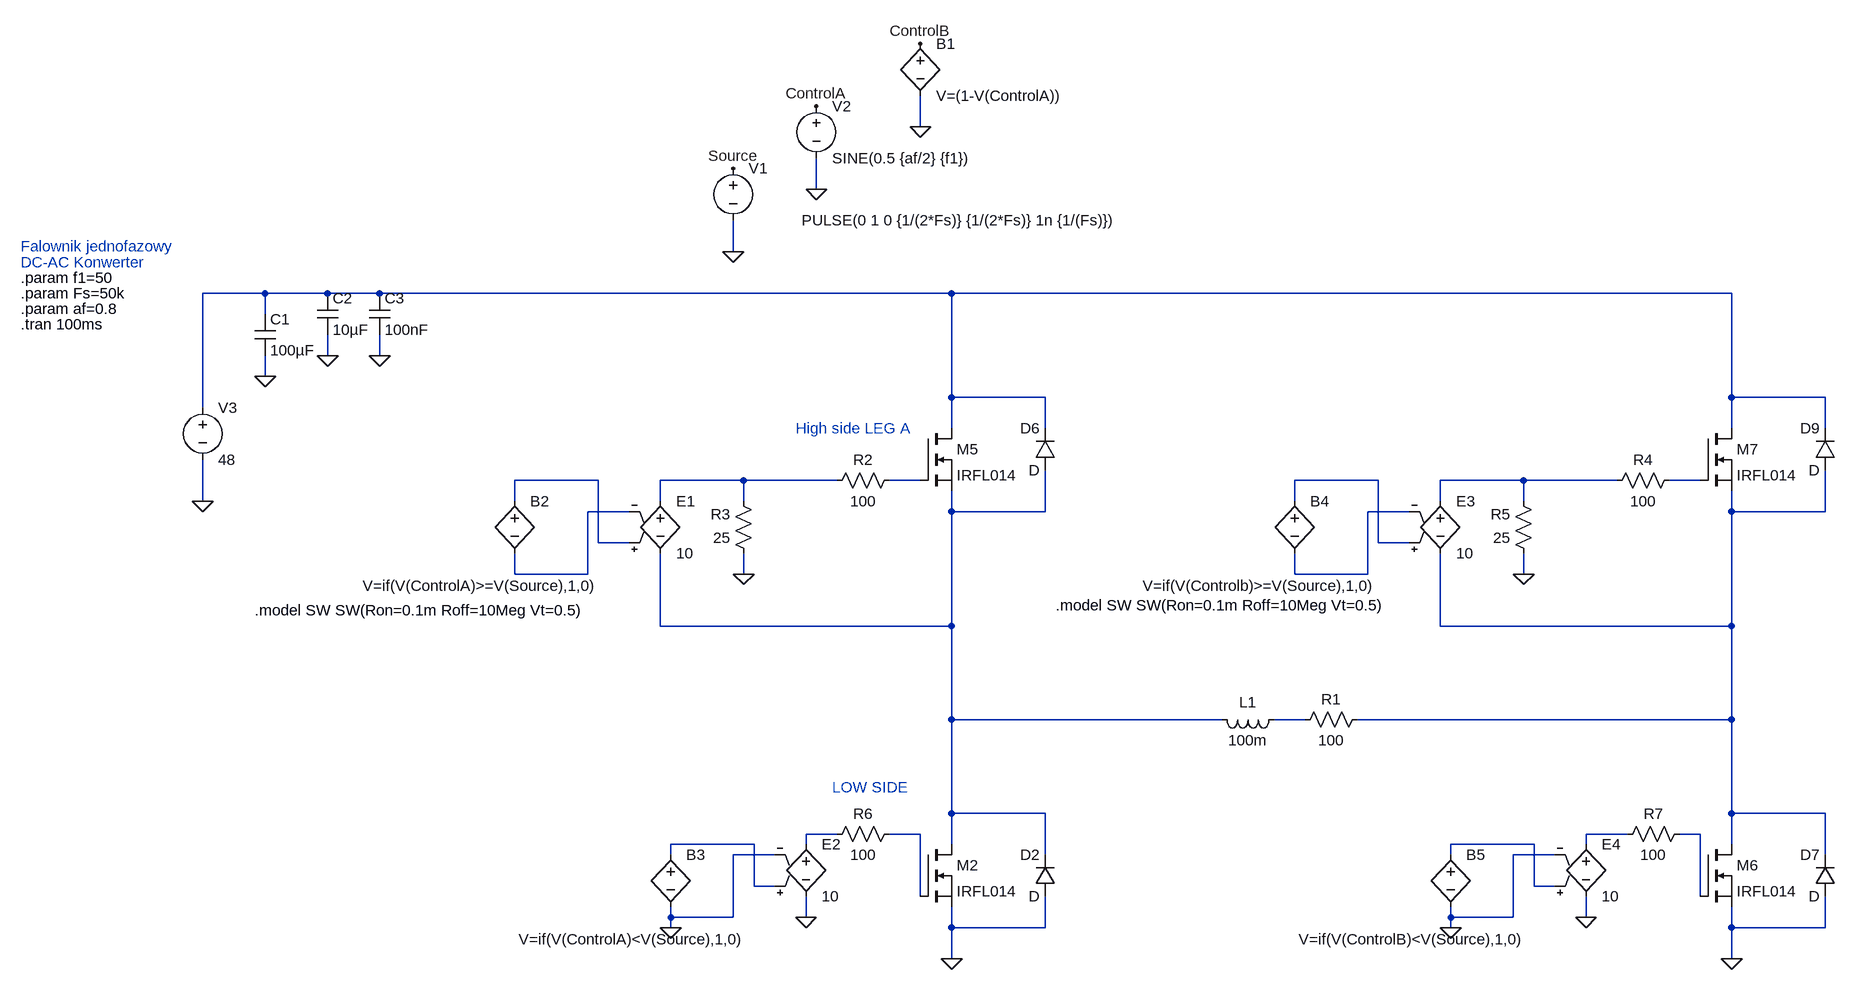
[diagram p0: schematic Falownik_driver.asc]
Falownik_driver.asc, the LTspice schematic file:
Version 4.1
SHEET 1 3828 1012
WIRE 1328 -288 1328 -336
WIRE 1168 -192 1168 -240
WIRE 1040 -96 1040 -144
WIRE 320 -32 224 -32
WIRE 416 -32 320 -32
WIRE 496 -32 416 -32
WIRE 1376 -32 496 -32
WIRE 2576 -32 1376 -32
WIRE 320 0 320 -32
WIRE 416 64 416 32
WIRE 496 64 496 32
WIRE 320 96 320 64
WIRE 1376 128 1376 -32
WIRE 1520 128 1376 128
WIRE 2576 128 2576 -32
WIRE 2720 128 2576 128
WIRE 224 144 224 -32
WIRE 1376 176 1376 128
WIRE 1520 176 1520 128
WIRE 2576 176 2576 128
WIRE 2720 176 2720 128
WIRE 832 256 704 256
WIRE 1056 256 928 256
WIRE 1200 256 1056 256
WIRE 1328 256 1280 256
WIRE 2032 256 1904 256
WIRE 2256 256 2128 256
WIRE 2400 256 2256 256
WIRE 2528 256 2480 256
WIRE 224 288 224 224
WIRE 704 288 704 256
WIRE 928 288 928 256
WIRE 1056 288 1056 256
WIRE 1904 288 1904 256
WIRE 2128 288 2128 256
WIRE 2256 288 2256 256
WIRE 880 304 816 304
WIRE 1376 304 1376 272
WIRE 1520 304 1520 240
WIRE 1520 304 1376 304
WIRE 2080 304 2016 304
WIRE 2576 304 2576 272
WIRE 2720 304 2720 240
WIRE 2720 304 2576 304
WIRE 832 352 832 256
WIRE 880 352 832 352
WIRE 2032 352 2032 256
WIRE 2080 352 2032 352
WIRE 704 400 704 368
WIRE 816 400 816 304
WIRE 816 400 704 400
WIRE 1056 400 1056 368
WIRE 1904 400 1904 368
WIRE 2016 400 2016 304
WIRE 2016 400 1904 400
WIRE 2256 400 2256 368
WIRE 928 480 928 368
WIRE 1376 480 1376 304
WIRE 1376 480 928 480
WIRE 2128 480 2128 368
WIRE 2576 480 2576 304
WIRE 2576 480 2128 480
WIRE 1376 624 1376 480
WIRE 1792 624 1376 624
WIRE 1920 624 1872 624
WIRE 2576 624 2576 480
WIRE 2576 624 2000 624
WIRE 1376 768 1376 624
WIRE 1520 768 1376 768
WIRE 2576 768 2576 624
WIRE 2720 768 2576 768
WIRE 1200 800 1152 800
WIRE 1328 800 1280 800
WIRE 2416 800 2352 800
WIRE 2528 800 2496 800
WIRE 1072 816 944 816
WIRE 1152 816 1152 800
WIRE 1376 816 1376 768
WIRE 2272 816 2144 816
WIRE 2352 816 2352 800
WIRE 2576 816 2576 768
WIRE 944 832 944 816
WIRE 1104 832 1040 832
WIRE 1520 832 1520 768
WIRE 2144 832 2144 816
WIRE 2304 832 2240 832
WIRE 2720 832 2720 768
WIRE 1072 880 1072 816
WIRE 1104 880 1072 880
WIRE 2272 880 2272 816
WIRE 2304 880 2272 880
WIRE 1328 896 1328 800
WIRE 2528 896 2528 800
WIRE 944 928 944 912
WIRE 1040 928 1040 832
WIRE 1040 928 944 928
WIRE 1152 928 1152 896
WIRE 2144 928 2144 912
WIRE 2240 928 2240 832
WIRE 2240 928 2144 928
WIRE 2352 928 2352 896
WIRE 944 944 944 928
WIRE 1376 944 1376 912
WIRE 1520 944 1520 896
WIRE 1520 944 1376 944
WIRE 2144 944 2144 928
WIRE 2576 944 2576 912
WIRE 2720 944 2720 896
WIRE 2720 944 2576 944
WIRE 1376 992 1376 944
WIRE 2576 992 2576 944
FLAG 1040 -96 0
FLAG 1168 -192 0
FLAG 1168 -320 ControlA
FLAG 1040 -224 Source
FLAG 1328 -288 0
FLAG 1328 -416 ControlB
FLAG 944 944 0
FLAG 1376 992 0
FLAG 224 288 0
FLAG 320 96 0
FLAG 1152 928 0
FLAG 416 64 0
FLAG 496 64 0
FLAG 1056 400 0
FLAG 2144 944 0
FLAG 2576 992 0
FLAG 2352 928 0
FLAG 2256 400 0
SYMBOL voltage 1040 -240 R0
WINDOW 3 594 96 Right 2
WINDOW 123 0 0 Left 0
WINDOW 39 0 0 Left 0
SYMATTR Value PULSE(0 1 0 {1/(2*Fs)} {1/(2*Fs)} 1n {1/(Fs)})
SYMATTR InstName V1
SYMBOL voltage 1168 -336 R0
WINDOW 123 0 0 Left 0
WINDOW 39 0 0 Left 0
SYMATTR InstName V2
SYMATTR Value SINE(0.5 {af/2} {f1})
SYMBOL bv 1328 -432 R0
SYMATTR InstName B1
SYMATTR Value V=(1-V(ControlA))
SYMBOL bv 704 272 R0
WINDOW 3 -234 146 Left 2
SYMATTR Value V=if(V(ControlA)>=V(Source),1,0)
SYMATTR InstName B2
SYMBOL e2 928 272 R0
SYMATTR InstName E1
SYMATTR Value 10
SYMBOL bv 944 816 R0
WINDOW 3 -234 146 Left 2
SYMATTR Value V=if(V(ControlA)<V(Source),1,0)
SYMATTR InstName B3
SYMBOL e2 1152 800 R0
SYMATTR InstName E2
SYMATTR Value 10
SYMBOL diode 1536 896 R180
WINDOW 0 24 64 Left 2
WINDOW 3 24 0 Left 2
SYMATTR InstName D2
SYMBOL bv 1904 272 R0
WINDOW 3 -234 146 Left 2
SYMATTR Value V=if(V(Controlb)>=V(Source),1,0)
SYMATTR InstName B4
SYMBOL e2 2128 272 R0
SYMATTR InstName E3
SYMATTR Value 10
SYMBOL bv 2144 816 R0
WINDOW 3 -234 146 Left 2
SYMATTR Value V=if(V(ControlB)<V(Source),1,0)
SYMATTR InstName B5
SYMBOL e2 2352 800 R0
SYMATTR InstName E4
SYMATTR Value 10
SYMBOL voltage 224 128 R0
WINDOW 123 0 0 Left 0
WINDOW 39 0 0 Left 0
SYMATTR InstName V3
SYMATTR Value 48
SYMBOL cap 304 0 R0
SYMATTR InstName C1
SYMATTR Value 100µF
SYMBOL res 2016 608 R90
WINDOW 0 0 56 VBottom 2
WINDOW 3 32 56 VTop 2
SYMATTR InstName R1
SYMATTR Value 100
SYMBOL ind 1888 608 R90
WINDOW 0 5 56 VBottom 2
WINDOW 3 32 56 VTop 2
SYMATTR InstName L1
SYMATTR Value 100m
SYMBOL nmos 1328 816 R0
SYMATTR InstName M2
SYMATTR Value IRFL014
SYMBOL cap 400 -32 R0
SYMATTR InstName C2
SYMATTR Value 10µF
SYMBOL cap 480 -32 R0
SYMATTR InstName C3
SYMATTR Value 100nF
SYMBOL nmos 1328 176 R0
SYMATTR InstName M5
SYMATTR Value IRFL014
SYMBOL res 1296 240 R90
WINDOW 0 0 56 VBottom 2
WINDOW 3 32 56 VTop 2
SYMATTR InstName R2
SYMATTR Value 100
SYMBOL res 1072 384 R180
WINDOW 0 36 76 Left 2
WINDOW 3 36 40 Left 2
SYMATTR InstName R3
SYMATTR Value 25
SYMBOL diode 1536 240 R180
WINDOW 0 24 64 Left 2
WINDOW 3 24 0 Left 2
SYMATTR InstName D6
SYMBOL diode 2736 896 R180
WINDOW 0 24 64 Left 2
WINDOW 3 24 0 Left 2
SYMATTR InstName D7
SYMBOL nmos 2528 816 R0
SYMATTR InstName M6
SYMATTR Value IRFL014
SYMBOL nmos 2528 176 R0
SYMATTR InstName M7
SYMATTR Value IRFL014
SYMBOL res 2496 240 R90
WINDOW 0 0 56 VBottom 2
WINDOW 3 32 56 VTop 2
SYMATTR InstName R4
SYMATTR Value 100
SYMBOL res 2272 384 R180
WINDOW 0 36 76 Left 2
WINDOW 3 36 40 Left 2
SYMATTR InstName R5
SYMATTR Value 25
SYMBOL diode 2736 240 R180
WINDOW 0 24 64 Left 2
WINDOW 3 24 0 Left 2
SYMATTR InstName D9
SYMBOL res 1296 784 R90
WINDOW 0 0 56 VBottom 2
WINDOW 3 32 56 VTop 2
SYMATTR InstName R6
SYMATTR Value 100
SYMBOL res 2512 784 R90
WINDOW 0 0 56 VBottom 2
WINDOW 3 32 56 VTop 2
SYMATTR InstName R7
SYMATTR Value 100
TEXT -56 -104 Left 2 ;Falownik jednofazowy
TEXT -56 -80 Left 2 ;DC-AC Konwerter
TEXT -56 -56 Left 2 !.param f1=50
TEXT -56 -32 Left 2 !.param Fs=50k
TEXT -56 -8 Left 2 !.param af=0.8
TEXT -56 16 Left 2 !.tran 100ms
TEXT 304 456 Left 2 !.model SW SW(Ron=0.1m Roff=10Meg Vt=0.5)
TEXT 1136 176 Left 2 ;High side LEG A
TEXT 1192 728 Left 2 ;LOW SIDE
TEXT 1536 448 Left 2 !.model SW SW(Ron=0.1m Roff=10Meg Vt=0.5)

The netlist it stands for:
* Falownik_driver.asc
V1 Source 0 PULSE(0 1 0 {1/(2*Fs)} {1/(2*Fs)} 1n {1/(Fs)})
V2 ControlA 0 SINE(0.5 {af/2} {f1})
B1 ControlB 0 V=(1-V(ControlA))
B2 N002 N008 V=if(V(ControlA)>=V(Source),1,0)
E1 N003 N009 N002 N008 10
B3 N017 0 V=if(V(ControlA)<V(Source),1,0)
E2 N013 0 N017 0 10
D2 0 N009 D
B4 N005 N010 V=if(V(Controlb)>=V(Source),1,0)
E3 N006 N011 N005 N010 10
B5 N018 0 V=if(V(ControlB)<V(Source),1,0)
E4 N015 0 N018 0 10
V3 N001 0 48
C1 N001 0 100µF
R1 N011 N012 100
L1 N012 N009 100m
M2 N009 N014 0 0 IRFL014
C2 N001 0 10µF
C3 N001 0 100nF
M5 N001 N004 N009 N009 IRFL014
R2 N004 N003 100
R3 0 N003 25
D6 N009 N001 D
D7 0 N011 D
M6 N011 N016 0 0 IRFL014
M7 N001 N007 N011 N011 IRFL014
R4 N007 N006 100
R5 0 N006 25
D9 N011 N001 D
R6 N014 N013 100
R7 N016 N015 100
.model D D
.lib standard.dio
.model NMOS NMOS
.model PMOS PMOS
.lib standard.mos
* Falownik jednofazowy
* DC-AC Konwerter
.param f1=50
.param Fs=50k
.param af=0.8
.tran 100ms
.model SW SW(Ron=0.1m Roff=10Meg Vt=0.5)
* High side LEG A
* LOW SIDE
.model SW SW(Ron=0.1m Roff=10Meg Vt=0.5)
.backanno
.end